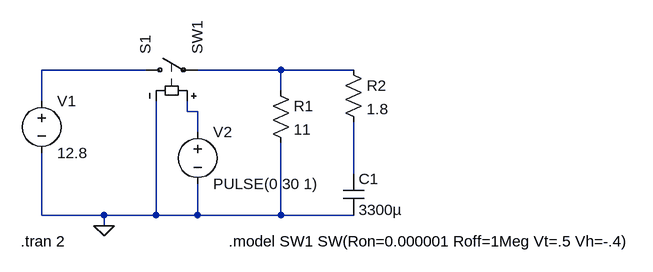
[diagram p0: schematic Motor_startng_model.asc]
Motor_startng_model.asc, the LTspice schematic file:
Version 4
SHEET 1 972 680
WIRE 128 96 -32 96
WIRE 336 96 208 96
WIRE 448 96 336 96
WIRE 336 128 336 96
WIRE -32 144 -32 96
WIRE 192 160 192 144
WIRE 208 160 192 160
WIRE 208 192 208 160
WIRE 448 256 448 176
WIRE -32 320 -32 224
WIRE 64 320 -32 320
WIRE 144 320 144 144
WIRE 144 320 64 320
WIRE 208 320 208 272
WIRE 208 320 144 320
WIRE 336 320 336 208
WIRE 336 320 208 320
WIRE 448 320 336 320
WIRE 64 336 64 320
FLAG 64 336 0
SYMBOL sw 112 96 R270
SYMATTR InstName S1
SYMATTR Value SW1
SYMBOL voltage -32 128 R0
WINDOW 123 0 0 Left 2
WINDOW 39 0 0 Left 2
SYMATTR InstName V1
SYMATTR Value 12.8
SYMBOL res 320 112 R0
SYMATTR InstName R1
SYMATTR Value 11
SYMBOL res 432 80 R0
SYMATTR InstName R2
SYMATTR Value 1.8
SYMBOL cap 432 256 R0
SYMATTR InstName C1
SYMATTR Value 3300µ
SYMBOL voltage 208 176 R0
WINDOW 123 0 0 Left 2
WINDOW 39 0 0 Left 2
SYMATTR InstName V2
SYMATTR Value PULSE(0 30 1)
TEXT -64 360 Left 2 !.tran 2
TEXT 256 360 Left 2 !.model SW1 SW(Ron=0.000001 Roff=1Meg Vt=.5 Vh=-.4)

The netlist it stands for:
* Motor_startng_model.asc
S1 N001 N002 N003 0 SW1
V1 N001 0 12.8
R1 N002 0 11
R2 N002 N004 1.8
C1 N004 0 3300µ
V2 N003 0 PULSE(0 30 1)
.tran 2
.model SW1 SW(Ron=0.000001 Roff=1Meg Vt=.5 Vh=-.4)
.backanno
.end